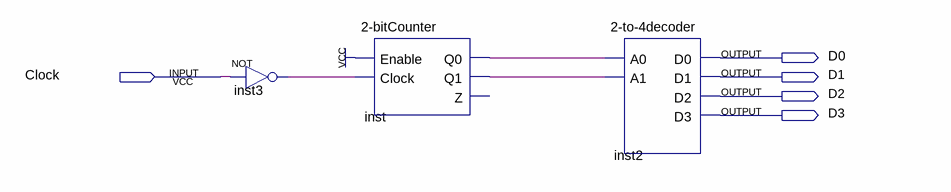
[diagram p0: schematic sheet]
// Quartus schematic upCounter.bdf as structural Verilog: 3 symbols, 5 pins
module upCounter (
  input  Clock,
  output D0,
  output D1,
  output D2,
  output D3
);

  wire inst3_out, inst_q0, inst_q1;

  not inst3 (inst3_out, Clock);
  \2-bitCounter  inst (.Enable(1'b1), .Clock(inst3_out), .Q0(inst_q0), .Q1(inst_q1));  // open: Z
  \2-to-4decoder  inst2 (.A0(inst_q0), .A1(inst_q1), .D0(D0), .D1(D1), .D2(D2), .D3(D3));
endmodule
